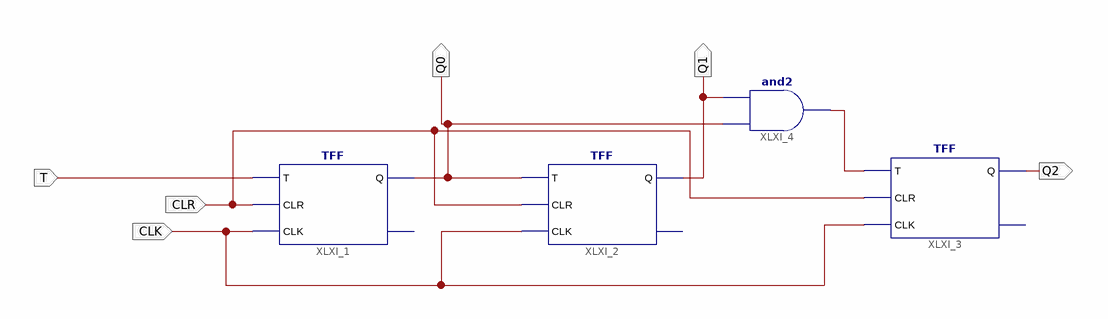
[diagram p0: schematic sheet 1]
// Xilinx ISE schematic syn_counter.sch (spartan3a) as structural Verilog: 4 symbols, 6 ports
module syn_counter (
  input  CLK,
  input  T,
  input  CLR,
  output Q1,
  output Q2,
  output Q0
);

  wire XLXN_5;

  TFF XLXI_1 (.T(T), .CLR(CLR), .CLK(CLK), .Q(Q0));  // open: Qb
  TFF XLXI_2 (.T(Q0), .CLR(CLR), .CLK(CLK), .Q(Q1));  // open: Qb
  TFF XLXI_3 (.T(XLXN_5), .CLR(CLR), .CLK(CLK), .Q(Q2));  // open: Qb
  and XLXI_4 (XLXN_5, Q0, Q1);
endmodule
